# Altium project Hub_card.PrjPcb
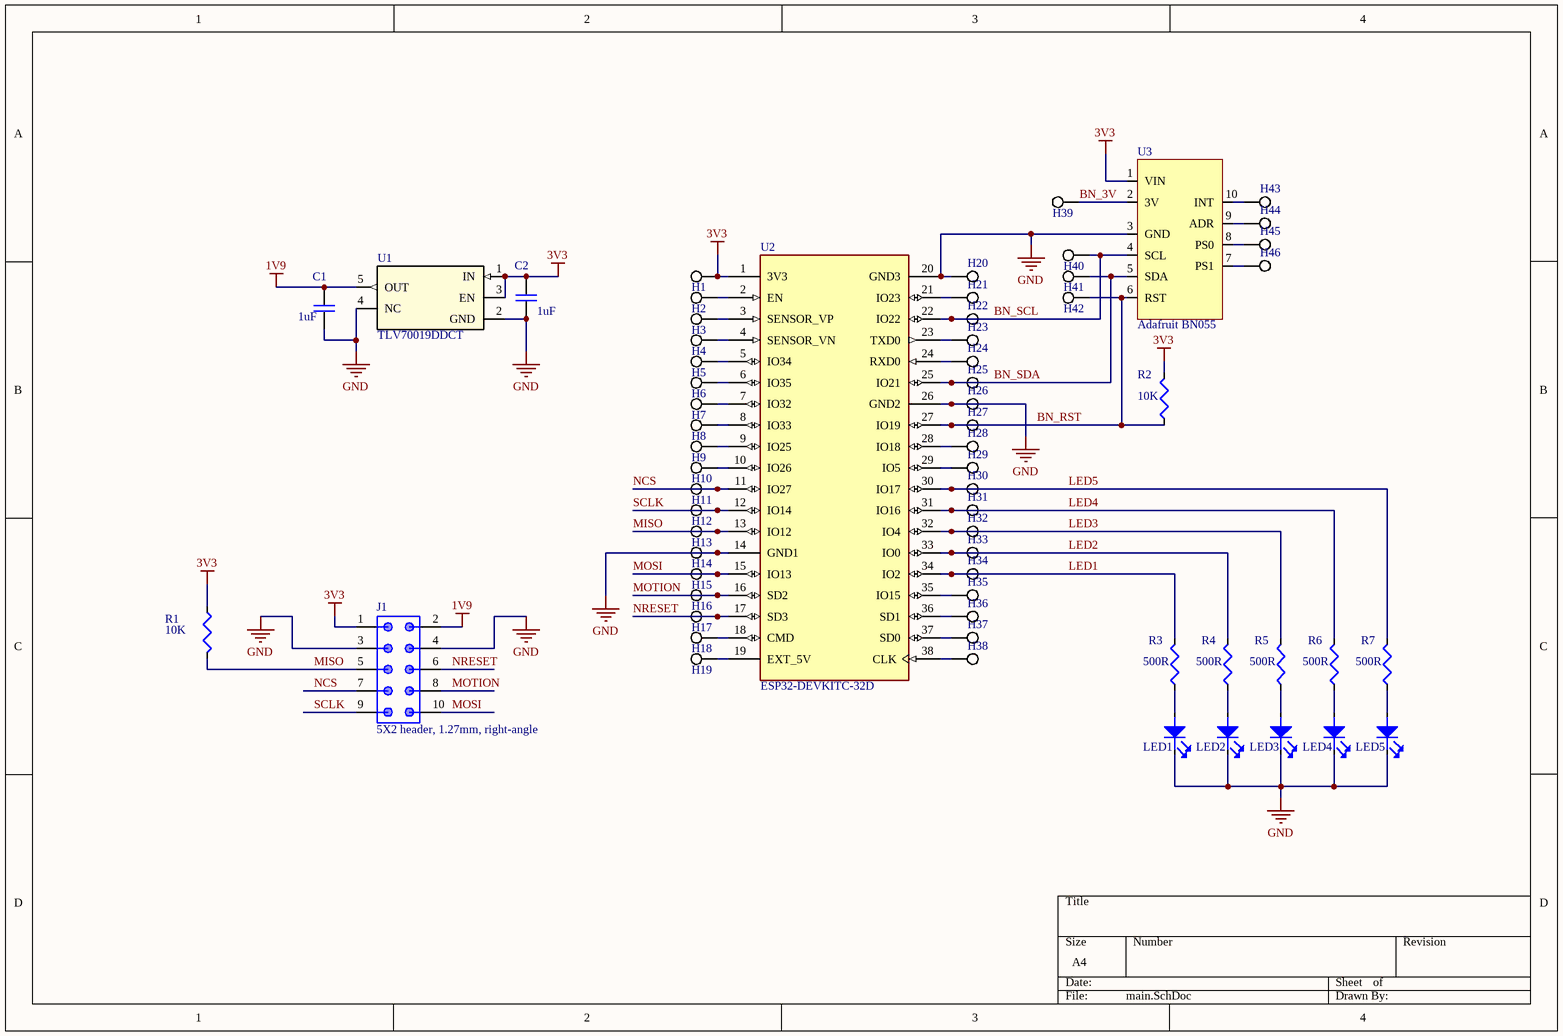
[diagram p0: main.SchDoc]
1 sheet, 64 parts. Net scope: global (net labels, ports and power ports of the same name join across sheets).
Board file: Hub_card.PcbDoc

## Sheet main.SchDoc
size A4; SheetNumber: 1; SheetTotal: 1

### Parts
C1  value 1uF  [C0805]  (hidden comment: 08053C105KAT2A)
C2  value 1uF  [C0805]  (hidden comment: 08053C105KAT2A)
H1  Via prove-point/connection  [Hole]  (value not drawn)
H2  Via prove-point/connection  [Hole]  (value not drawn)
H3  Via prove-point/connection  [Hole]  (value not drawn)
H4  Via prove-point/connection  [Hole]  (value not drawn)
H5  Via prove-point/connection  [Hole]  (value not drawn)
H6  Via prove-point/connection  [Hole]  (value not drawn)
H7  Via prove-point/connection  [Hole]  (value not drawn)
H8  Via prove-point/connection  [Hole]  (value not drawn)
H9  Via prove-point/connection  [Hole]  (value not drawn)
H10  Via prove-point/connection  [Hole]  (value not drawn)
H11  Via prove-point/connection  [Hole]  (value not drawn)
H12  Via prove-point/connection  [Hole]  (value not drawn)
H13  Via prove-point/connection  [Hole]  (value not drawn)
H14  Via prove-point/connection  [Hole]  (value not drawn)
H15  Via prove-point/connection  [Hole]  (value not drawn)
H16  Via prove-point/connection  [Hole]  (value not drawn)
H17  Via prove-point/connection  [Hole]  (value not drawn)
H18  Via prove-point/connection  [Hole]  (value not drawn)
H19  Via prove-point/connection  [Hole]  (value not drawn)
H20  Via prove-point/connection  [Hole]  (value not drawn)
H21  Via prove-point/connection  [Hole]  (value not drawn)
H22  Via prove-point/connection  [Hole]  (value not drawn)
H23  Via prove-point/connection  [Hole]  (value not drawn)
H24  Via prove-point/connection  [Hole]  (value not drawn)
H25  Via prove-point/connection  [Hole]  (value not drawn)
H26  Via prove-point/connection  [Hole]  (value not drawn)
H27  Via prove-point/connection  [Hole]  (value not drawn)
H28  Via prove-point/connection  [Hole]  (value not drawn)
H29  Via prove-point/connection  [Hole]  (value not drawn)
H30  Via prove-point/connection  [Hole]  (value not drawn)
H31  Via prove-point/connection  [Hole]  (value not drawn)
H32  Via prove-point/connection  [Hole]  (value not drawn)
H33  Via prove-point/connection  [Hole]  (value not drawn)
H34  Via prove-point/connection  [Hole]  (value not drawn)
H35  Via prove-point/connection  [Hole]  (value not drawn)
H36  Via prove-point/connection  [Hole]  (value not drawn)
H37  Via prove-point/connection  [Hole]  (value not drawn)
H38  Via prove-point/connection  [Hole]  (value not drawn)
H39  Via prove-point/connection  [Hole]  (value not drawn)
H40  Via prove-point/connection  [Hole]  (value not drawn)
H41  Via prove-point/connection  [Hole]  (value not drawn)
H42  Via prove-point/connection  [Hole]  (value not drawn)
H43  Via prove-point/connection  [Hole]  (value not drawn)
H44  Via prove-point/connection  [Hole]  (value not drawn)
H45  Via prove-point/connection  [Hole]  (value not drawn)
H46  Via prove-point/connection  [Hole]  (value not drawn)
J1  5X2 header, 1.27mm, right-angle  [5X2 header, 1.27mm, right-angle]
LED1  LED Blue  [L0603 BLUE]  (value not drawn)
LED2  LED Blue  [L0603 BLUE]  (value not drawn)
LED3  LED Blue  [L0603 BLUE]  (value not drawn)
LED4  LED Blue  [L0603 BLUE]  (value not drawn)
LED5  LED Blue  [L0603 BLUE]  (value not drawn)
R1  value 10K  [R0603]  (hidden comment: CPF-A-0603B100KE1)
R2  value 10K  [R0603]  (hidden comment: CPF-A-0603B100KE1)
R3  value 500R  [R0603]  (hidden comment: CPF-A-0603B100KE1)
R4  value 500R  [R0603]  (hidden comment: CPF-A-0603B100KE1)
R5  value 500R  [R0603]  (hidden comment: CPF-A-0603B100KE1)
R6  value 500R  [R0603]  (hidden comment: CPF-A-0603B100KE1)
R7  value 500R  [R0603]  (hidden comment: CPF-A-0603B100KE1)
U1  TLV70019DDCT  [TLV70019DDCT]
U2  ESP32-DEVKITC-32D  [ESP32]
U3  Adafruit BN055  [Adafruit BN055]

### Nets
1V9: C1.2 J1.2 U1.5(OUT)
3V3: C2.2 H1.1 J1.1 R1.2 R2.2 U1.1(IN) U1.3(EN) U2.1(3V3) U3.1(VIN)
GND: C1.1 C2.1 H14.1 H20.1 H26.1 J1.3 J1.4 LED1.2 LED2.2 LED3.2 LED4.2 LED5.2 U1.2(GND) U1.4(NC) U2.14(GND1) U2.20(GND3) U2.26(GND2) U3.3(GND)
BN_3V: H39.1 U3.2(3V)
BN_RST: H27.1 H42.1 R2.1 U2.27(IO19) U3.6(RST)
BN_SCL: H22.1 H40.1 U2.22(IO22) U3.4(SCL)
BN_SDA: H25.1 H41.1 U2.25(IO21) U3.5(SDA)
LED1: H34.1 R3.2 U2.34(IO2)
LED2: H33.1 R4.2 U2.33(IO0)
LED3: H32.1 R5.2 U2.32(IO4)
LED4: H31.1 R6.2 U2.31(IO16)
LED5: H30.1 R7.2 U2.30(IO17)
MISO: H13.1 J1.5 R1.1 U2.13(IO12)
MOSI: H15.1 J1.10 U2.15(IO13)
MOTION: H16.1 J1.8 U2.16(SD2)
NCS: H11.1 J1.7 U2.11(IO27)
NRESET: H17.1 J1.6 U2.17(SD3)
SCLK: H12.1 J1.9 U2.12(IO14)
NetH2_1: H2.1 U2.2(EN)
NetH3_1: H3.1 U2.3(SENSOR_VP)
NetH4_1: H4.1 U2.4(SENSOR_VN)
NetH5_1: H5.1 U2.5(IO34)
NetH6_1: H6.1 U2.6(IO35)
NetH7_1: H7.1 U2.7(IO32)
NetH8_1: H8.1 U2.8(IO33)
NetH9_1: H9.1 U2.9(IO25)
NetH10_1: H10.1 U2.10(IO26)
NetH18_1: H18.1 U2.18(CMD)
NetH19_1: H19.1 U2.19(EXT_5V)
NetH21_1: H21.1 U2.21(IO23)
NetH23_1: H23.1 U2.23(TXD0)
NetH24_1: H24.1 U2.24(RXD0)
NetH28_1: H28.1 U2.28(IO18)
NetH29_1: H29.1 U2.29(IO5)
NetH35_1: H35.1 U2.35(IO15)
NetH36_1: H36.1 U2.36(SD1)
NetH37_1: H37.1 U2.37(SD0)
NetH38_1: H38.1 U2.38(CLK)
NetH43_1: H43.1 U3.10(INT)
NetH44_1: H44.1 U3.9(ADR)
NetH45_1: H45.1 U3.8(PS0)
NetH46_1: H46.1 U3.7(PS1)
NetLED1_1: LED1.1 R3.1
NetLED2_1: LED2.1 R4.1
NetLED3_1: LED3.1 R5.1
NetLED4_1: LED4.1 R6.1
NetLED5_1: LED5.1 R7.1

### Library data of the parts
C1 C2 = 08053C105KAT2A: C0805
H1-H46 = Hole
LED1-LED5 = HSMG-C199: LED 0603 Blue; Color: Blue
R1-R7 = CPF-A-0603B100KE1: R0603
U2 = ESP32-DEVKITC-32D: ESP32-DEVKITC-32D module.
U1 = TLV70019DDCT: ComponentLink1Description: New link; ComponentLink1URL: https://no.farnell.com/texas-instruments/tlv70019ddct/ldo-reg-0-175vdo-0-2a-1-9v-5sot23/dp/3007766RL?st=regulator; Supplier 1: Digi-Key; Supplier Part Number 1: 296-30508-1-ND